# EAGLE schematic LM5116 (EAGLE 9.6.2)
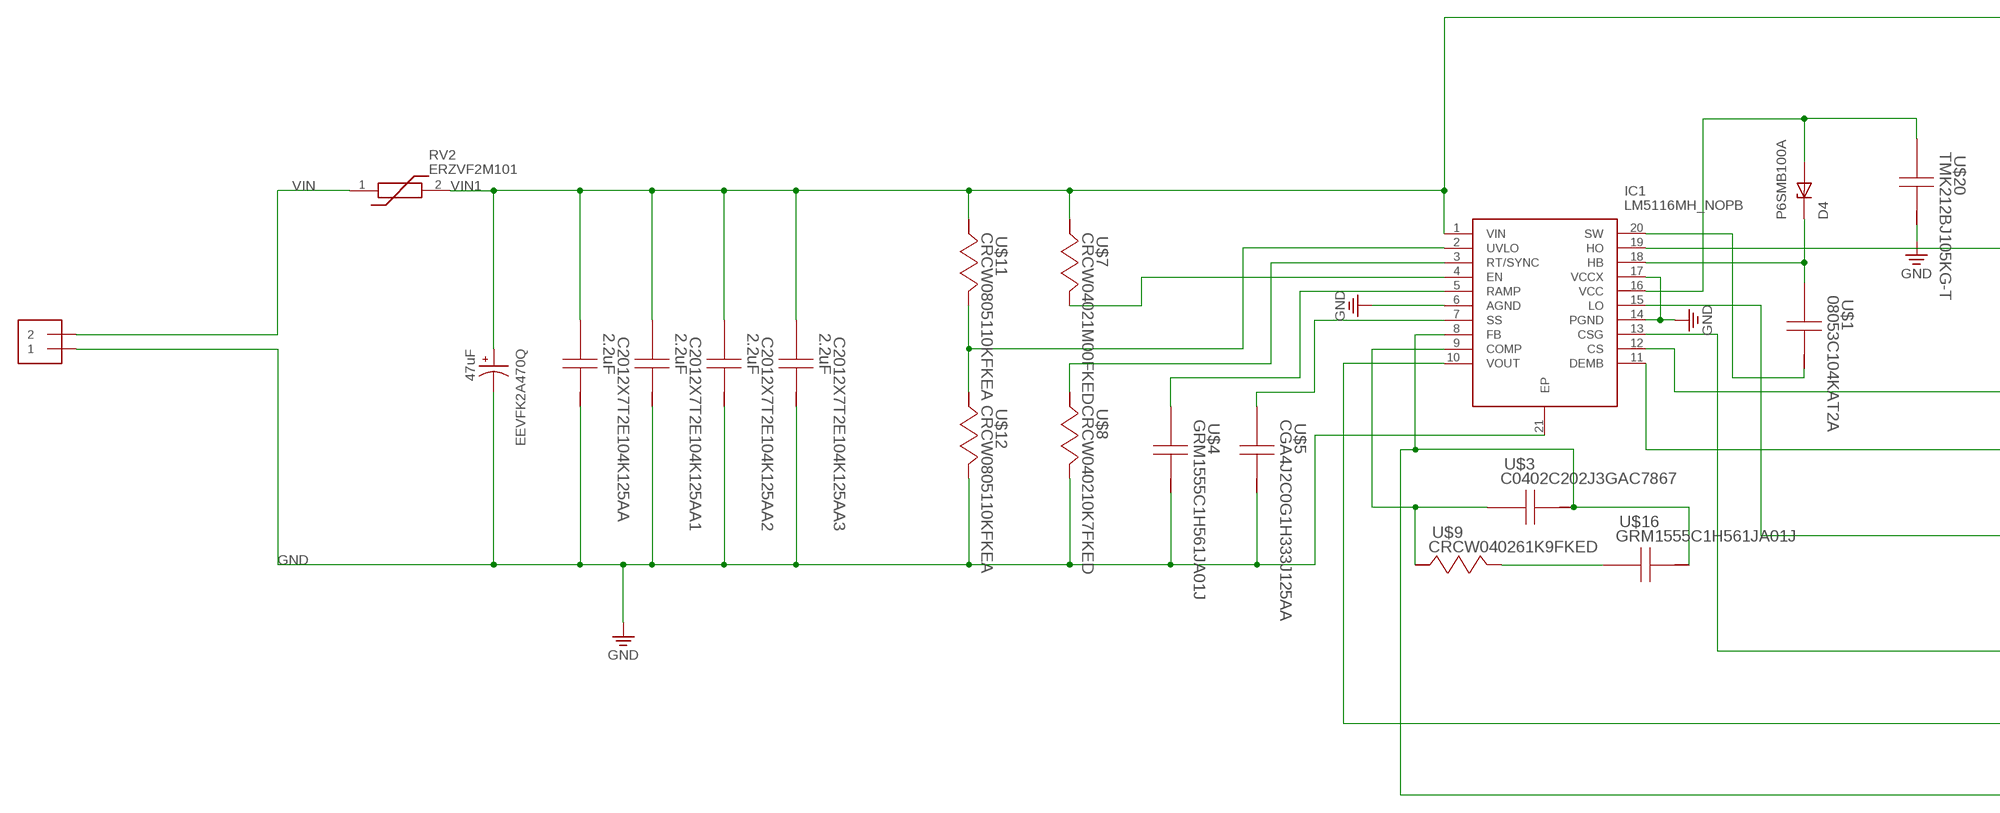
[diagram p0: schematic, sheet 1, part 1 of 2]
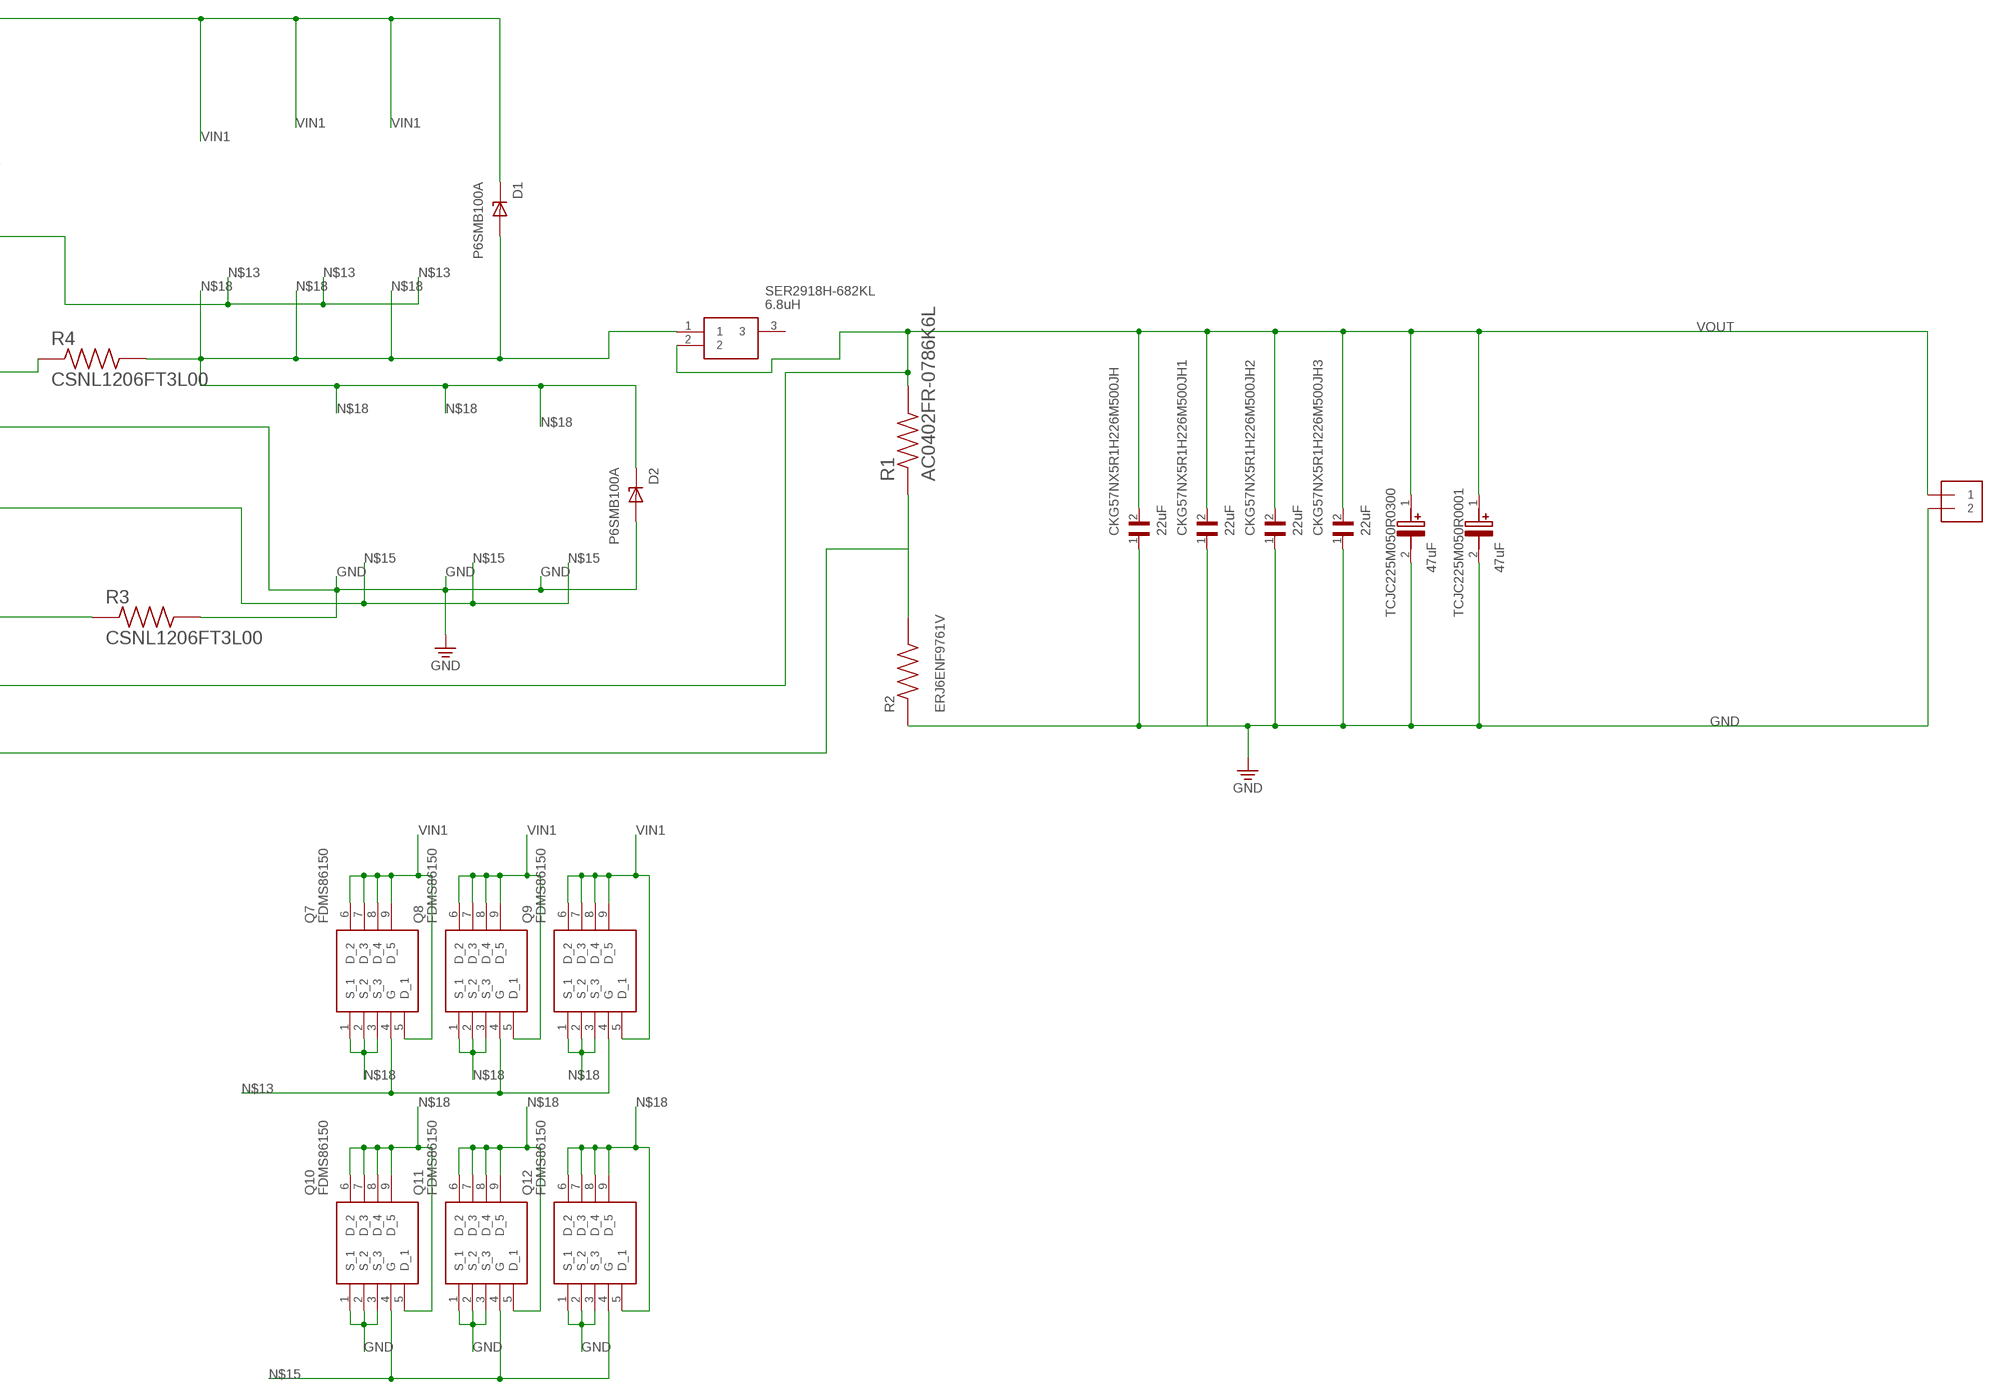
[diagram p1: schematic, sheet 1, part 2 of 2]

## Parts
C2012X7T2E104K125AA  2.2uF  C2012X7T2E104K125AA  [0805]
C2012X7T2E104K125AA1  2.2uF  C2012X7T2E104K125AA  [0805]
C2012X7T2E104K125AA2  2.2uF  C2012X7T2E104K125AA  [0805]
C2012X7T2E104K125AA3  2.2uF  C2012X7T2E104K125AA  [0805]
CKG57NX5R1H226M500JH  22uF  CKG57NX5R1H226M500JH  [CAPC6050X550N]
CKG57NX5R1H226M500JH1  22uF  CKG57NX5R1H226M500JH  [CAPC6050X550N]
CKG57NX5R1H226M500JH2  22uF  CKG57NX5R1H226M500JH  [CAPC6050X550N]
CKG57NX5R1H226M500JH3  22uF  CKG57NX5R1H226M500JH  [CAPC6050X550N]
D1  P6SMB100A  [DIOM4336X265N]
D2  P6SMB100A  [DIOM4336X265N]
D4  P6SMB100A  [DIOM4336X265N]
EEVFK2A470Q  47uF  EEVFK2A470Q  [CAP_EEVFK2A470Q]
IC1  LM5116MH_NOPB  [SOP65P640X110-21N]
J1  1X2-3.5MM  [1X2-3.5MM]
J2  1X2-3.5MM  [1X2-3.5MM]
Q7  FDMS86150  [FDMS86150]
Q8  FDMS86150  [FDMS86150]
Q9  FDMS86150  [FDMS86150]
Q10  FDMS86150  [FDMS86150]
Q11  FDMS86150  [FDMS86150]
Q12  FDMS86150  [FDMS86150]
R1  AC0402FR-0786K6L  [RESC1005X37N]
R2  ERJ6ENF9761V  [RES_ERJ6ENF9761V]
R3  CSNL1206FT3L00  [RESC3216X90N]
R4  CSNL1206FT3L00  [RESC3216X90N]
RV2  ERZVF2M101  [ERZVF2M101]
SER2918H-682KL  6.8uH  SER2918H-682KL  [SER2918H333KL]
TCJC225M050R0001  47uF  TCJC225M050R0300  [CAPPM6032X280N]
TCJC225M050R0300  47uF  TCJC225M050R0300  [CAPPM6032X280N]
U$1  08053C104KAT2A  [0805]
U$3  C0402C202J3GAC7867  [0402]
U$4  GRM1555C1H561JA01J  [0402]
U$5  CGA4J2C0G1H333J125AA  [0805]
U$7  CRCW04021M00FKED  [0402]
U$8  CRCW040210K7FKED  [0402]
U$9  CRCW040261K9FKED  CRCW040216K9FKED  [0402]
U$11  CRCW0805110KFKEA  [0805]
U$12  CRCW0805110KFKEA  [0805]
U$16  GRM1555C1H561JA01J  [0402]
U$20  TMK212BJ105KG-T  [0805]

## Nets
GND: C2012X7T2E104K125AA1.1 C2012X7T2E104K125AA2.1 C2012X7T2E104K125AA3.1 C2012X7T2E104K125AA.1 CKG57NX5R1H226M500JH1.1 CKG57NX5R1H226M500JH2.1 CKG57NX5R1H226M500JH3.1 CKG57NX5R1H226M500JH.1 D2.A EEVFK2A470Q.2 IC1.6(AGND) IC1.11(DEMB) IC1.14(PGND) IC1.17(VCCX) IC1.21(EP) J1.1 J2.2 Q10.1(S_1) Q10.2(S_2) Q10.3(S_3) Q11.1(S_1) Q11.2(S_2) Q11.3(S_3) Q12.1(S_1) Q12.2(S_2) Q12.3(S_3) R2.1 R3.2 TCJC225M050R0001.2(-) TCJC225M050R0300.2(-) U$4.1 U$5.1 U$8.1 U$12.1 U$20.1
N$2: IC1.2(UVLO) U$11.1 U$12.2
N$3: IC1.3(RT/SYNC) U$8.2
N$4: IC1.5(RAMP) U$4.2
N$5: IC1.7(SS) U$5.2
N$6: IC1.9(COMP) U$3.2 U$9.2
N$7: IC1.4(EN) U$7.1
N$9: U$9.1 U$16.2
N$10: D4.C IC1.18(HB) U$1.2
N$11: IC1.20(SW) U$1.1
N$12: D4.A IC1.16(VCC) U$20.2
N$13: IC1.19(HO) Q7.4(G) Q8.4(G) Q9.4(G)
N$14: IC1.8(FB) R1.1 R2.2 U$3.1 U$16.1
N$15: IC1.15(LO) Q10.4(G) Q11.4(G) Q12.4(G)
N$16: IC1.12(CS) R4.1
N$18: D1.A D2.C Q7.1(S_1) Q7.2(S_2) Q7.3(S_3) Q8.1(S_1) Q8.2(S_2) Q8.3(S_3) Q9.1(S_1) Q9.2(S_2) Q9.3(S_3) Q10.5(D_1) Q10.6(D_2) Q10.7(D_3) Q10.8(D_4) Q10.9(D_5) Q11.5(D_1) Q11.6(D_2) Q11.7(D_3) Q11.8(D_4) Q11.9(D_5) Q12.5(D_1) Q12.6(D_2) Q12.7(D_3) Q12.8(D_4) Q12.9(D_5) R4.2 SER2918H-682KL.1
N$21: IC1.13(CSG) R3.1
VIN: J1.2 RV2.1
VIN1: C2012X7T2E104K125AA1.2 C2012X7T2E104K125AA2.2 C2012X7T2E104K125AA3.2 C2012X7T2E104K125AA.2 D1.C EEVFK2A470Q.1 IC1.1(VIN) Q7.5(D_1) Q7.6(D_2) Q7.7(D_3) Q7.8(D_4) Q7.9(D_5) Q8.5(D_1) Q8.6(D_2) Q8.7(D_3) Q8.8(D_4) Q8.9(D_5) Q9.5(D_1) Q9.6(D_2) Q9.7(D_3) Q9.8(D_4) Q9.9(D_5) RV2.2 U$7.2 U$11.2
VOUT: CKG57NX5R1H226M500JH1.2 CKG57NX5R1H226M500JH2.2 CKG57NX5R1H226M500JH3.2 CKG57NX5R1H226M500JH.2 IC1.10(VOUT) J2.1 R1.2 SER2918H-682KL.2 TCJC225M050R0001.1(+) TCJC225M050R0300.1(+)
Unconnected: SER2918H-682KL.3

## Library data of the parts
C2012X7T2E104K125AA C2012X7T2E104K125AA1-C2012X7T2E104K125AA3 = LM5116_paket_:C2012X7T2E104K125AA; MANUFACTURER_PART_NUMBER: C2012X7T2E104K125AA; VENDOR: TDK
CKG57NX5R1H226M500JH CKG57NX5R1H226M500JH1-CKG57NX5R1H226M500JH3 = 50V_CKG57NX5R1H226M500JH:CKG57NX5R1H226M500JH: 22 µF ±20% 50V Ceramic Capacitor X5R Stacked SMD, 2 J-Lead Check availability <https://pricing.snapeda.com/parts/CKG57NX5R1H226M500JH/TDK%20Electronics/view-part?ref=eda>; AVAILABILITY: In Stock; DESCRIPTION: 22 µF ±20% 50V Ceramic Capacitor X5R Stacked SMD, 2 J-Lead; MF: TDK Electronics; MP: CKG57NX5R1H226M500JH; PACKAGE: None; PRICE: None; PURCHASE-URL: https://pricing.snapeda.com/search/part/CKG57NX5R1H226M500JH/?ref=eda
D1 D2 D4 = P6SMB100A:P6SMB100A; DESCRIPTION: 600W, 100V, 5%, Unidirectional, TVS; DIGI-KEY_PART_NUMBER: 1801-P6SMB100ATR-ND; MF: Taiwan Semiconductor; MP: P6SMB100A; PACKAGE: SMD-2 Taiwan Semiconductor; PURCHASE-URL: https://pricing.snapeda.com/search/part/P6SMB100A/?ref=eda
EEVFK2A470Q = EEVFK2A470Q:EEVFK2A470Q: Check availability <https://pricing.snapeda.com/parts/EEV-FK2A470Q/Panasonic/view-part?ref=eda>; AVAILABILITY: In Stock; DESCRIPTION: 47µF 100V Aluminum Electrolytic Capacitors Radial, Can - SMD 5000 Hrs @ 105°C; MF: Panasonic; MP: EEV-FK2A470Q; PACKAGE: RADIAL-2 Panasonic; PRICE: None; PURCHASE-URL: https://pricing.snapeda.com/search/part/EEV-FK2A470Q/?ref=eda
IC1 = LM5116MH_NOPB:LM5116MH_NOPB: DC-DC Controller Sync Buck 100V TSSOP20 Texas Instruments LM5116MH/NOPB, DC-DC Controller Step-Up, Synchronous, 1000 kHz, 20-Pin, TSSOP EP Source: Datasheet <http://www.ti.com/lit/ds/symlink/lm5116.pdf>; ARROW_PART_NUMBER: LM5116MH/NOPB; ARROW_PRICE-STOCK: https://www.arrow.com/en/products/lm5116mhnopb/texas-instruments?region=nac; DESCRIPTION: DC-DC Controller Sync Buck 100V TSSOP20 Texas Instruments LM5116MH/NOPB, DC-DC Controller Step-Up, Synchronous, 1000 kHz, 20-Pin, TSSOP EP; HEIGHT: 1.1mm; MANUFACTURER_NAME: Texas Instruments; MANUFACTURER_PART_NUMBER: LM5116MH/NOPB; MOUSER_PART_NUMBER: 926-LM5116MH/NOPB; MOUSER_PRICE-STOCK: https://www.mouser.co.uk/ProductDetail/Texas-Instruments/LM5116MH-NOPB?qs=QbsRYf82W3Gc%2FVeEKgyaCw%3D%3D
J1 J2 = adafruit:1X2: 3.5mm Terminal block http://www.ladyada.net/library/pcb/eaglelibrary.html
Q7-Q12 = FDMS86150:FDMS86150: ON SEMICONDUCTOR - FDMS86150 - Power MOSFET, N Channel, 100 V, 80 A, 0.0039 ohm, Power 56, Surface Mount Source: Datasheet <https://www.onsemi.com/pdf/datasheet/fdms86150-d.pdf>; ARROW_PART_NUMBER: FDMS86150; ARROW_PRICE-STOCK: https://www.arrow.com/en/products/fdms86150/on-semiconductor?region=nac; DESCRIPTION: ON SEMICONDUCTOR - FDMS86150 - Power MOSFET, N Channel, 100 V, 80 A, 0.0039 ohm, Power 56, Surface Mount; HEIGHT: 1.1mm; MANUFACTURER_NAME: onsemi; MANUFACTURER_PART_NUMBER: FDMS86150; MOUSER_PART_NUMBER: 512-FDMS86150; MOUSER_PRICE-STOCK: https://www.mouser.co.uk/ProductDetail/onsemi-Fairchild/FDMS86150?qs=inGVrKucXPsdNNWylCtN8A%3D%3D
R1 = AC0402FR-0786K6L:AC0402FR-0786K6L: RES SMD 86.6K OHM 1% 1/16W 0402; DESCRIPTION: 86.6 kOhms ±1% 0.063W, 1/16W Chip Resistor 0402 (1005 Metric) Automotive AEC-Q200, Moisture Resistant Thick Film; DIGI-KEY_PART_NUMBER: YAG5692TR-ND; MF: Yageo; MP: AC0402FR-0786K6L; PACKAGE: 1005 Yageo; PURCHASE-URL: https://pricing.snapeda.com/search/part/AC0402FR-0786K6L/?ref=eda
R2 = ERJ6ENF9761V:ERJ6ENF9761V; DESCRIPTION: 9.76 kOhms 1% 0.125W, 1/8W Chip Resistor 0805 (2012 Metric) Automotive AEC-Q200 Thick Film; DIGI-KEY_PART_NUMBER: P9.76KCTR-ND; MF: Panasonic Electronic; MP: ERJ-6ENF9761V; PACKAGE: 2012-2 Panasonic; PURCHASE-URL: https://pricing.snapeda.com/search/part/ERJ-6ENF9761V/?ref=eda
R3 R4 = CSNL1206FT3L00:CSNL1206FT3L00: CSNL 1206 2 W 0.003O ±1% ±50 ppm/°C Metal Foil Current Sensing Chip Resistor; DESCRIPTION: 3 mOhms ±1% 1W Chip Resistor 1206 (3216 Metric) Current Sense, Moisture Resistant Metal Element; DIGI-KEY_PART_NUMBER: CSNL1206FT3L00TR-ND; MF: Stackpole Electronics; MP: CSNL1206FT3L00; PACKAGE: 1206 Stackpole Electronics; PURCHASE-URL: https://pricing.snapeda.com/search/part/CSNL1206FT3L00/?ref=eda
RV2 = 125V_ERZVF2M101:ERZVF2M101: Series/Type: Varistor SMD type Series VF, Varistor Voltage (V): 100, Varistor Voltage (Range) (V): 90 - 110, Maximum Allowable Voltage ACrms (V): 60, Maximum Allowable Voltage DC (V): 85, Maximum Energy (2ms) (J): 4, Maximum Peak Current (8/20 s) (A): 600 Source: Datasheet <https://industrial.panasonic.com/cdbs/www-data/pdf/AWA0000/AWA0000C4.pdf>; DESCRIPTION: Series/Type: Varistor SMD type Series VF, Varistor Voltage (V): 100, Varistor Voltage (Range) (V): 90 - 110, Maximum Allowable Voltage ACrms (V): 60, Maximum Allowable Voltage DC (V): 85, Maximum Energy (2ms) (J): 4, Maximum Peak Current (8/20 s) (A): 600; HEIGHT: 3.5mm; MANUFACTURER_NAME: Panasonic; MANUFACTURER_PART_NUMBER: ERZVF2M101
SER2918H-682KL = SER2918H-682KL:SER2918H-682KL: COILCRAFT - SER2918H-682KL - INDUCTOR, PWR, 6.8UH, 28A,0.1, 25MHZ Source: Datasheet <https://www.coilcraft.com/pdfs/ser2900.pdf>; DESCRIPTION: COILCRAFT - SER2918H-682KL - INDUCTOR, PWR, 6.8UH, 28A,0.1, 25MHZ; HEIGHT: 17mm; MANUFACTURER_NAME: COILCRAFT; MANUFACTURER_PART_NUMBER: SER2918H-682KL; MOUSER_PART_NUMBER: 994-SER2918H-682KL; MOUSER_PRICE-STOCK: https://www.mouser.co.uk/ProductDetail/Coilcraft/SER2918H-682KL?qs=zCSbvcPd3pYbZ%252Bi1A6xqww%3D%3D
TCJC225M050R0001 TCJC225M050R0300 = TCJC225M050R0300:TCJC225M050R0300: 2.2 F Molded Tantalum Polymer Capacitor 50 V 2312 (6032 Metric) 300mOhm @ 100kHz Source: Datasheet <http://datasheets.avx.com/TCJ.pdf>; DESCRIPTION: 2.2 F Molded Tantalum Polymer Capacitor 50 V 2312 (6032 Metric) 300mOhm @ 100kHz; HEIGHT: 2.8mm; MANUFACTURER_NAME: AVX; MANUFACTURER_PART_NUMBER: TCJC225M050R0300
U$1 = LM5116_paket_:08053C104KAT2A; MANUFACTURER_PART_NUMBER: 08053C104KAT2A; VENDOR: AVX
U$3 = LM5116_paket_:C0402C202J3GAC7867; MANUFACTURER_PART_NUMBER: C0402C202J3GAC7867; VENDOR: Kemet
U$4 U$16 = LM5116_paket_:GRM1555C1H561JA01J; MANUFACTURER_PART_NUMBER: GRM1555C1H561JA01J; VENDOR: MuRata
U$5 = LM5116_paket_:CGA4J2C0G1H333J125AA; MANUFACTURER_PART_NUMBER: CGA4J2C0G1H333J125AA; VENDOR: TDK
U$7 = LM5116_paket_:CRCW04021M00FKED; MANUFACTURER_PART_NUMBER: CRCW04021M00FKED; VENDOR: VishayDale
U$8 = LM5116_paket_:CRCW040210K7FKED; MANUFACTURER_PART_NUMBER: CRCW040210K7FKED; VENDOR: VishayDale
U$9 = LM5116_paket_:CRCW040216K9FKED; MANUFACTURER_PART_NUMBER: CRCW040216K9FKED; VENDOR: VishayDale
U$11 U$12 = LM5116_paket_:CRCW0805110KFKEA; MANUFACTURER_PART_NUMBER: CRCW0805110KFKEA; VENDOR: VishayDale
U$20 = LM5116_paket_:TMK212BJ105KG-T; MANUFACTURER_PART_NUMBER: TMK212BJ105KGT; VENDOR: Taiyo Yuden